# EAGLE design untitled (EAGLE 9.6.2)
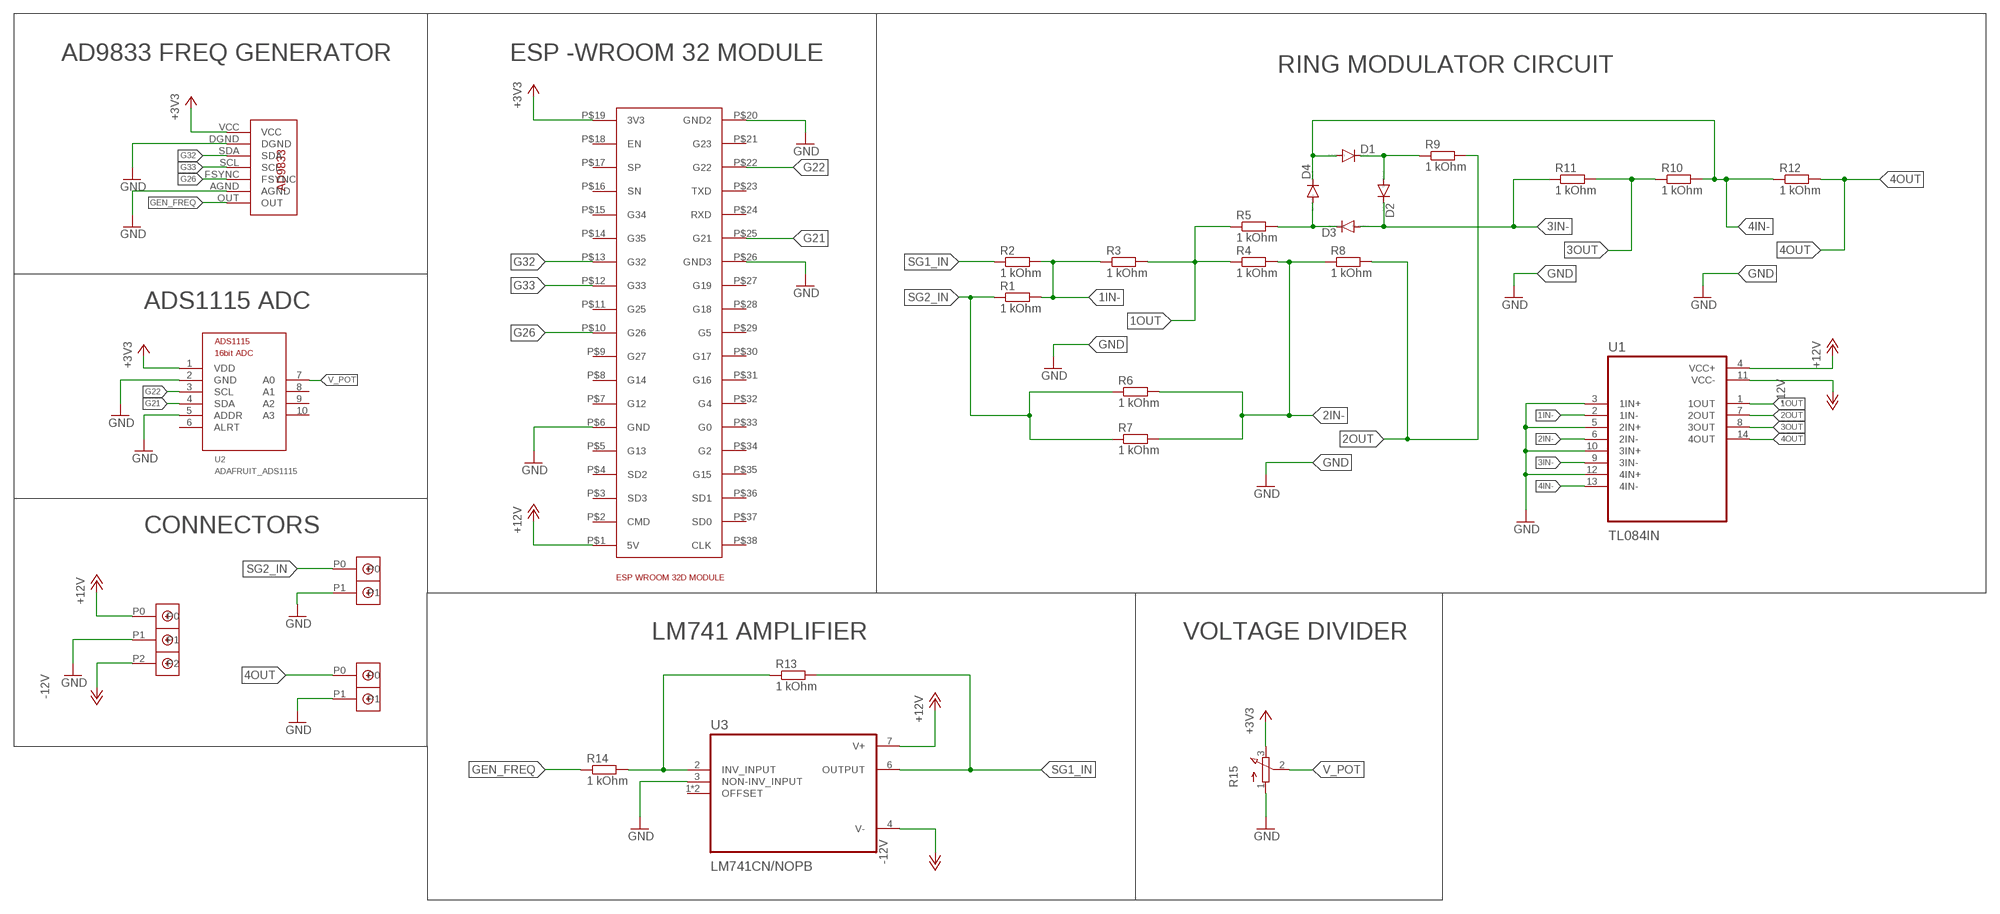
[diagram p0: schematic, sheet 1]

## Parts
D1  1N4148DO35-7  [DO35-7]
D2  1N4148DO35-7  [DO35-7]
D3  1N4148DO35-7  [DO35-7]
D4  1N4148DO35-7  [DO35-7]
R1  1 kOhm  R-EU_0204/7  [0204/7]
R2  1 kOhm  R-EU_0204/7  [0204/7]
R3  1 kOhm  R-EU_0204/7  [0204/7]
R4  1 kOhm  R-EU_0204/7  [0204/7]
R5  1 kOhm  R-EU_0204/7  [0204/7]
R6  1 kOhm  R-EU_0204/7  [0204/7]
R7  1 kOhm  R-EU_0204/7  [0204/7]
R8  1 kOhm  R-EU_0204/7  [0204/7]
R9  1 kOhm  R-EU_0204/7  [0204/7]
R10  1 kOhm  R-EU_0204/7  [0204/7]
R11  1 kOhm  R-EU_0204/7  [0204/7]
R12  1 kOhm  R-EU_0204/7  [0204/7]
R13  1 kOhm  R-EU_0204/7  [0204/7]
R14  1 kOhm  R-EU_0204/7  [0204/7]
R15  3RP/1610N  [3RP/1610N]
U1  TL084IN  [DIP794W45P254L1969H508Q14]
U2  ADAFRUIT_ADS1115  [ADAFRUIT_ADS1115_16BIT_I2C_ADC]
U3  LM741CN/NOPB  [DIP794W45P254L959H508Q8]
U$1  ESP32  [ESP32]
U$2  A9833  [AD9833]
U$3  DBCONN-1X2  [DBCONN-1X2]
U$4  DBCONN-1X3  [DBCONN-1X3]
U$5  DBCONN-1X2  [DBCONN-1X2]

## Nets
1IN-: R1.2 R2.2 R3.1 U1.2(1IN-)
1OUT: R3.2 R4.1 R5.1 U1.1(1OUT)
2IN-: R4.2 R6.2 R7.2 R8.1 U1.6(2IN-)
2OUT: R8.2 R9.2 U1.7(2OUT)
3IN-: D2.C D3.A R11.1 U1.9(3IN-)
3OUT: R10.1 R11.2 U1.8(3OUT)
4IN-: D1.A D4.C R10.2 R12.1 U1.13(4IN-)
4OUT: R12.2 U1.14(4OUT) U$5.P0
+3V3: R15.3(E) U2.1(VDD) U$1.P$19(3V3) U$2.VCC
+12V: U1.4(VCC+) U3.7(V+) U$1.P$1(5V) U$4.P0
-12V: U1.11(VCC-) U3.4(V-) U$4.P2
G21: U2.4(SDA) U$1.P$25(G21)
G22: U2.3(SCL) U$1.P$22(G22)
G26: U$1.P$10(G26) U$2.FSYNC
G32: U$1.P$13(G32) U$2.SDA
G33: U$1.P$12(G33) U$2.SCL
GEN_FREQ: R14.1 U$2.OUT
GND: R15.1(A) U1.3(1IN+) U1.5(2IN+) U1.10(3IN+) U1.12(4IN+) U2.2(GND) U2.5(ADDR) U3.3(NON-INV_INPUT) U$1.P$6(GND) U$1.P$20(GND2) U$1.P$26(GND3) U$2.AGND U$2.DGND U$3.P1 U$4.P1 U$5.P1
N$1: D3.C D4.A R5.2
N$3: D1.C D2.A R9.1
N$4: R13.1 R14.2 U3.2(INV_INPUT)
SG1_IN: R2.1 R13.2 U3.6(OUTPUT)
SG2_IN: R1.1 R6.1 R7.1 U$3.P0
V_POT: R15.2(S) U2.7(A0)
Unconnected: U2.6(ALRT) U2.8(A1) U2.9(A2) U2.10(A3) U3.1(OFFSET) U3.5(OFFSET) U$1.P$2(CMD) U$1.P$3(SD3) U$1.P$4(SD2) U$1.P$5(G13) U$1.P$7(G12) U$1.P$8(G14) U$1.P$9(G27) U$1.P$11(G25) U$1.P$14(G35) U$1.P$15(G34) U$1.P$16(SN) U$1.P$17(SP) U$1.P$18(EN) U$1.P$21(G23) U$1.P$23(TXD) U$1.P$24(RXD) U$1.P$27(G19) U$1.P$28(G18) U$1.P$29(G5) U$1.P$30(G17) U$1.P$31(G16) U$1.P$32(G4) U$1.P$33(G0) U$1.P$34(G2) U$1.P$35(G15) U$1.P$36(SD1) U$1.P$37(SD0) U$1.P$38(CLK)

## Notes on the sheet
- AD9833 FREQ GENERATOR | ESP -WROOM 32 MODULE
- RING MODULATOR CIRCUIT
- ADS1115 ADC
- CONNECTORS
- LM741 AMPLIFIER | VOLTAGE DIVIDER

## Library data of the parts
D1-D4 = diode:1N4148: DIODE high speed (Philips)
R1-R14 = rcl:R-EU_: RESISTOR, European symbol; SPICEPREFIX: R
R15 = pot:3RP/1610N: 16mm Potentiometer one level Source: http://www.alphapotentiometers.net/html/16mm_pot_2.html
U1 = TL084IN:TL084IN: Check availability <https://pricing.snapeda.com/parts/TL084IN/STMicroelectronics/view-part?ref=eda>; AVAILABILITY: In Stock; DESCRIPTION: J-FET Amplifier 4 Circuit - 14-DIP; MF: STMicroelectronics; MP: TL084IN; PACKAGE: DIP-14 Motorola; PRICE: None; PURCHASE-URL: https://pricing.snapeda.com/search?q=TL084IN&ref=eda
U2 = ADS1115:ADAFRUIT_ADS1115
U3 = LM741CN_NOPB:LM741CN/NOPB: Check availability <https://pricing.snapeda.com/parts/LM741CN/Texas%20Instruments/view-part?ref=eda>; AVAILABILITY: In Stock; DESCRIPTION: Operational Amplifiers - Op Amps Operational Amplifier 8-PDIP 0 to 70; MF: Texas Instruments; MP: LM741CN; PACKAGE: DIP-8 NXP Semiconductors; PRICE: None; PURCHASE-URL: https://pricing.snapeda.com/search?q=LM741CN&ref=eda
U$1 = [module]ESP32:ESP32
U$2 = AD9833:A9833
U$3 U$5 = Terminal Block Connector:DBCONN-1X2
U$4 = Terminal Block Connector:DBCONN-1X3

## Board
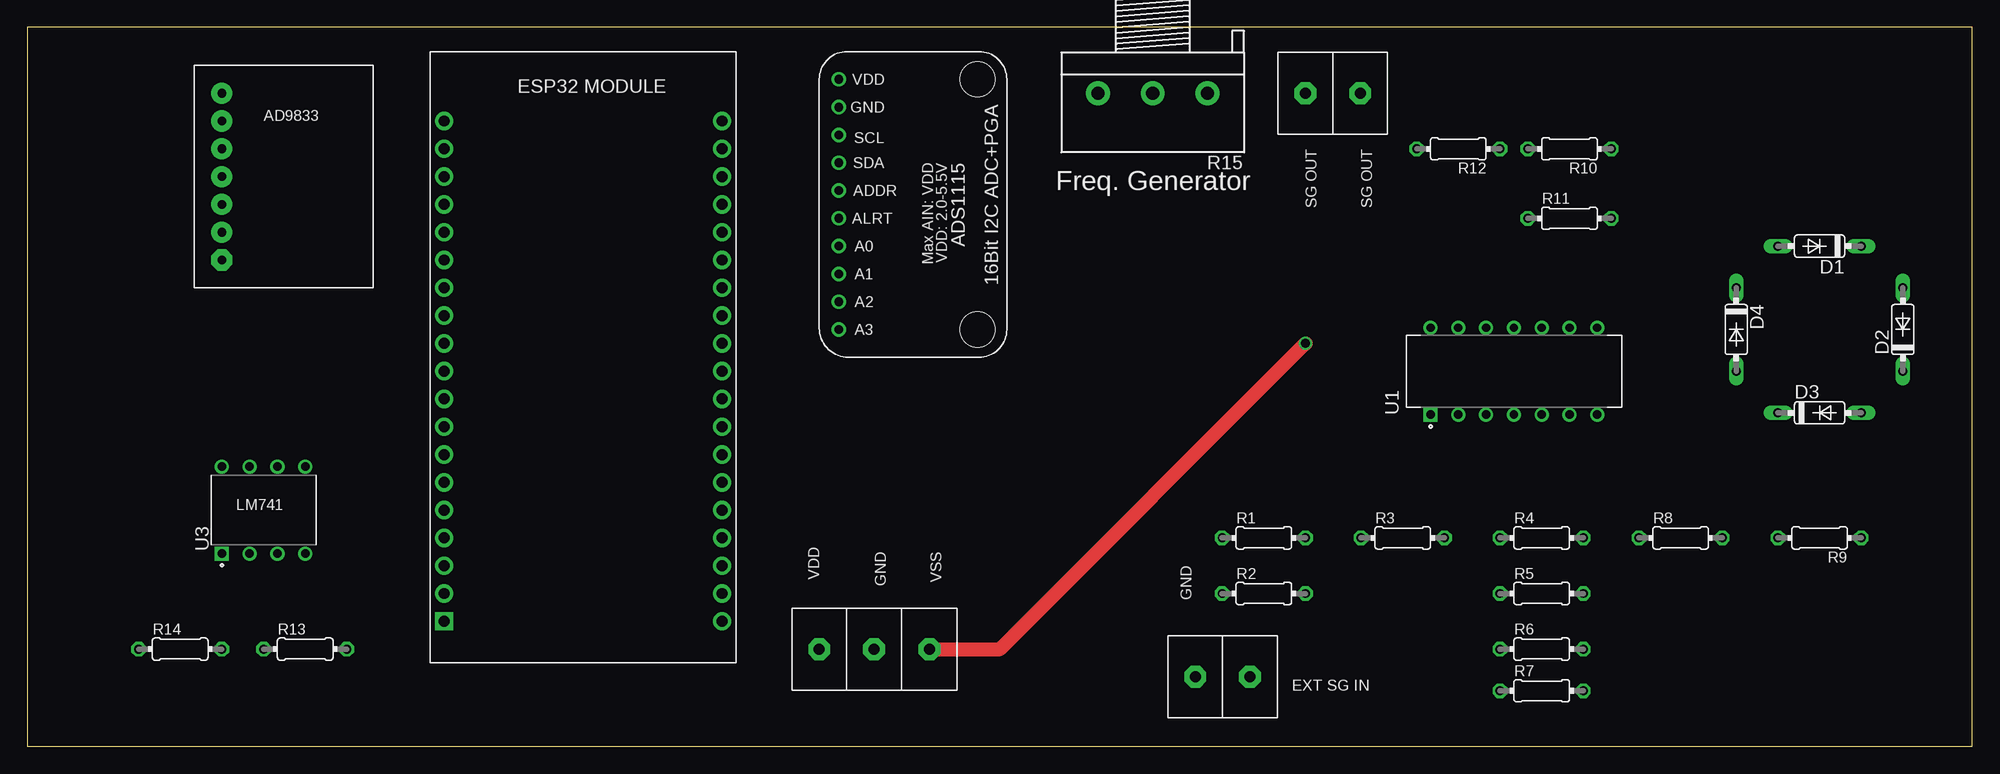
[diagram p1: board, top side]
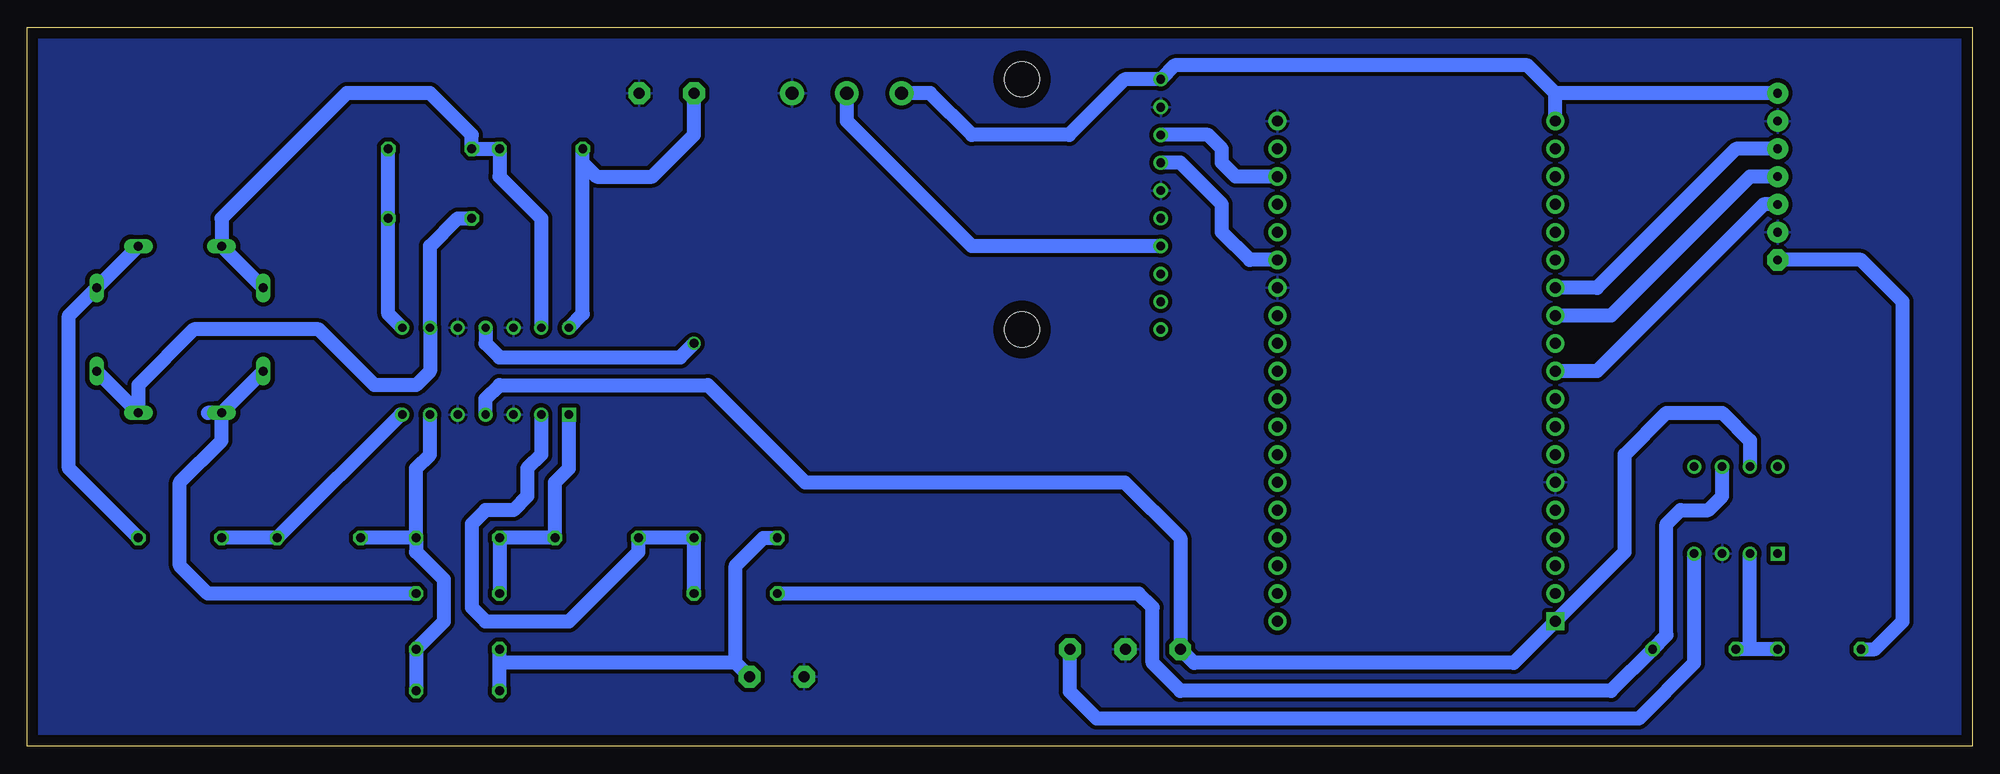
[diagram p2: board, bottom side, seen from below]

Size 177.78 x 65.71 mm. Coordinates in mm from the lower left corner, seen from the top.
Outline: 0,0 177.78,0 177.78,65.71 0,65.71 0,0
Copper layers (1*16): Top 0.035mm / dielectric 1.5mm / Bottom 0.035mm
Design rules "default": minimum track width 6mil, minimum drill 0.35mm, track to track 6mil, track to pad 6mil, pad to pad 6mil, via to via 6mil, smd to smd 6mil, copper to edge 40mil, drill to drill 6mil, minimum pad ring 10mil, minimum via ring 8mil, stop-mask expansion 4mil, vias tented up to drill 0mil, thermal gap 10mil

### Footprints (pad centres in the part's own frame; a part is rotated, then mirrored left to right if it is on the bottom)
DO35-7 = drill 0.813 long: A 3.81,0; C -3.81,0
0204/7 = drill 0.813 octagon: 1 -3.81,0; 2 3.81,0
3RP/1610N = drill 1.2 pad 2.184: 1 -5,0; 2 0,0; 3 5,0
DIP794W45P254L1969H508Q14 = drill 0.77 pad 1.17 square: 1 -3.97,7.62 | drill 0.77 pad 1.17: 2 -3.97,5.08; 3 -3.97,2.54; 4 -3.97,0; 5 -3.97,-2.54; 6 -3.97,-5.08; 7 -3.97,-7.62; 8 3.97,-7.62; 9 3.97,-5.08; 10 3.97,-2.54; 11 3.97,0; 12 3.97,2.54; 13 3.97,5.08; 14 3.97,7.62
ADAFRUIT_ADS1115_16BIT_I2C_ADC = drill 0.8: 1 2.54,1.778; 2 5.08,1.778; 3 7.62,1.778; 4 10.16,1.778; 5 12.7,1.778; 6 15.24,1.778; 7 17.78,1.778; 8 20.32,1.778; 9 22.86,1.778; 10 25.4,1.778 | hole 3.2: 2.54,14.478; 25.4,14.478
DIP794W45P254L959H508Q8 = drill 0.78 pad 1.13 square: 1 -3.97,3.81 | drill 0.78 pad 1.13: 2 -3.97,1.27; 3 -3.97,-1.27; 4 -3.97,-3.81; 5 3.97,-3.81; 6 3.97,-1.27; 7 3.97,1.27; 8 3.97,3.81
ESP32 = drill 1 pad 1.676 square: P$1 1.27,3.81 | drill 1 pad 1.676: P$2 1.27,6.35; P$3 1.27,8.89; P$4 1.27,11.43; P$5 1.27,13.97; P$6 1.27,16.51; P$7 1.27,19.05; P$8 1.27,21.59; P$9 1.27,24.13; P$10 1.27,26.67; P$11 1.27,29.21; P$12 1.27,31.75; P$13 1.27,34.29; P$14 1.27,36.83; P$15 1.27,39.37; P$16 1.27,41.91; P$17 1.27,44.45; P$18 1.27,46.99; P$19 1.27,49.53; P$20 26.67,49.53; P$21 26.67,46.99; P$22 26.67,44.45; P$23 26.67,41.91; P$24 26.67,39.37; P$25 26.67,36.83; P$26 26.67,34.29; P$27 26.67,31.75; P$28 26.67,29.21; P$29 26.67,26.67; P$30 26.67,24.13; P$31 26.67,21.59; P$32 26.67,19.05; P$33 26.67,16.51; P$34 26.67,13.97; P$35 26.67,11.43; P$36 26.67,8.89; P$37 26.67,6.35; P$38 26.67,3.81
AD9833 = drill 0.8 pad 1.93: AGND 0,2.54; DGND 0,12.7; FSYNC 0,5.08; SCL 0,7.62; SDA 0,10.16; VCC 0,15.24 | drill 0.8 pad 1.93 octagon: OUT 0,0
DBCONN-1X2 = drill 1 pad 2 octagon: P0 -2.54,0; P1 2.46,0
DBCONN-1X3 = drill 1 pad 2 octagon: P0 2.54,3.81; P1 7.54,3.81; P2 12.62,3.81

### Placement (x,y rotation side)
D1  163.83,45.72 180 top
D2  171.45,38.1 90 top
D3  163.83,30.48 0 top
D4  156.21,38.1 270 top
R1  113.03,19.05 0 top
R2  113.03,13.97 0 top
R3  125.73,19.05 0 top
R4  138.43,19.05 0 top
R5  138.43,13.97 0 top
R6  138.43,8.89 0 top
R7  138.43,5.08 0 top
R8  151.13,19.05 0 top
R9  163.83,19.05 180 top
R10  140.97,54.61 180 top
R11  140.97,48.26 0 top
R12  130.81,54.61 180 top
R13  25.4,8.89 0 top
R14  13.97,8.89 0 top
R15  102.87,59.69 180 top
U1  135.89,34.29 90 top
U2  72.39,63.5 270 top
U3  21.59,21.59 90 top
U$1  36.83,7.62 0 top
U$2  17.78,44.45 0 top
U$3  109.22,6.35 180 top
U$4  69.85,5.08 0 top
U$5  119.38,59.69 0 top

### Tracks (layer width: path | path; a pad name or v marks a point on that pad's centre or on a via)
1IN-
  Bottom 1.27: R2.2 R1.2 R3.1 121.92,17.78 128.27,11.43 135.89,11.43 137.16,12.7 137.16,20.32 135.89,21.59 133.35,21.59 132.08,22.86 132.08,25.4 130.81,26.67 U1.2
1OUT
  Bottom 1.27: U1.1 128.27,25.4 129.54,24.13 R3.2 R4.1 R5.1
2IN-
  Bottom 1.27: R4.2 R8.1 | R4.2 142.24,25.4 140.97,26.67 U1.6 | R4.2 142.24,17.78 139.7,15.24 139.7,11.43 R6.2 R7.2
2OUT
  Bottom 1.27: R9.2 R8.2 143.67,30.32 U1.7
3IN-
  Bottom 1.27: D2.C D3.A 167.64,33.02 162.56,38.1 151.13,38.1 146.05,33.02 142.24,33.02 140.97,34.29 U1.9 140.97,45.72 138.43,48.26 R11.1
3OUT
  Bottom 1.27: U1.8 144.78,39.53 R11.2 R10.1
4IN-
  Bottom 1.27: D4.C D1.A 160.02,48.26 148.59,59.69 140.97,59.69 137.16,55.88 R10.2 R12.1 134.62,52.07 130.81,48.26 U1.13
4OUT
  Bottom 1.27: U1.14 127,39.53 127,53.34 | 127,53.34 R12.2 | 127,53.34 125.73,52.07 120.65,52.07 116.84,55.88 U$5.P0
+3V3
  Bottom 1.27: U$1.P$19 38.1,59.69 | 38.1,59.69 40.64,62.23 72.9,62.23 U2.1 77.47,60.96 82.55,55.88 91.44,55.88 95.25,59.69 R15.3 | U$2.VCC 38.1,59.69
+12V
  Bottom 1.27: U3.7 20.32,27.94 22.86,30.48 27.94,30.48 31.75,26.67 31.75,17.78 U$1.P$1 41.91,7.62 71.12,7.62 U$4.P0 72.39,19.05 77.47,24.13 106.68,24.13 115.57,33.02 134.62,33.02 135.89,31.75 U1.4
-12V  (via drill 0.8)
  Top 1.27: v116.84,36.83 88.9,8.89 U$4.P2
  Bottom 1.27: U1.11 135.89,36.83 134.62,35.56 118.11,35.56 v116.84,36.83 | U3.4 25.4,7.62 30.48,2.54 80.01,2.54 82.47,5 U$4.P2
G21
  Bottom 1.27: U$1.P$25 66.04,44.45 68.58,46.99 68.58,49.53 72.39,53.34 U2.4
G22
  Bottom 1.27: U$1.P$22 67.31,52.07 68.58,53.34 68.58,54.61 69.85,55.88 U2.3
G26
  Bottom 1.27: U$2.FSYNC 19.05,49.53 34.29,34.29 U$1.P$10
G32
  Bottom 1.27: U$2.SDA 21.59,54.61 34.29,41.91 U$1.P$13
G33
  Bottom 1.27: U$2.SCL 20.32,52.07 33.02,39.37 U$1.P$12
GEN_FREQ
  Bottom 1.27: R14.1 8.89,8.89 6.35,11.43 6.35,40.64 10.16,44.45 U$2.OUT
GND
  pour Bottom (isolate 0.381): 0,66.04 0,0 177.8,0 177.8,66.04
N$1
  Bottom 1.27: D4.A D3.C | D3.C 161.29,30.48 | R5.2 161.29,13.97 163.83,16.51 163.83,24.13 160.02,27.94 D3.C
N$3
  Bottom 1.27: D1.C D2.A 173.99,39.37 173.99,25.4 R9.1
N$4
  Bottom 1.27: R14.2 20.32,8.89 | 20.32,8.89 R13.1 | 20.32,8.89 U3.2
SG1_IN
  Bottom 1.27: U3.6 22.86,22.86 24.13,21.59 26.67,21.59 27.94,20.32 27.94,10.16 R13.2 33.02,5.08 72.39,5.08 74.93,7.62 74.93,12.7 76.2,13.97 R2.1
SG2_IN
  Bottom 1.27: R7.1 134.62,7.62 | 134.62,7.62 R6.1 | 113.03,7.62 134.62,7.62 | U$3.P0 113.03,7.62 | R1.1 110.49,19.05 113.03,16.51 113.03,7.62
V_POT
  Bottom 1.27: U2.7 91.44,45.72 102.87,57.15 R15.2

### Text on the board
tNames: AD9833 | SG OUT | SG OUT | Freq. Generator | LM741 | GND | VSS | GND | VDD | EXT SG IN